# Altium schematic sheet MCU.SchDoc
size A4
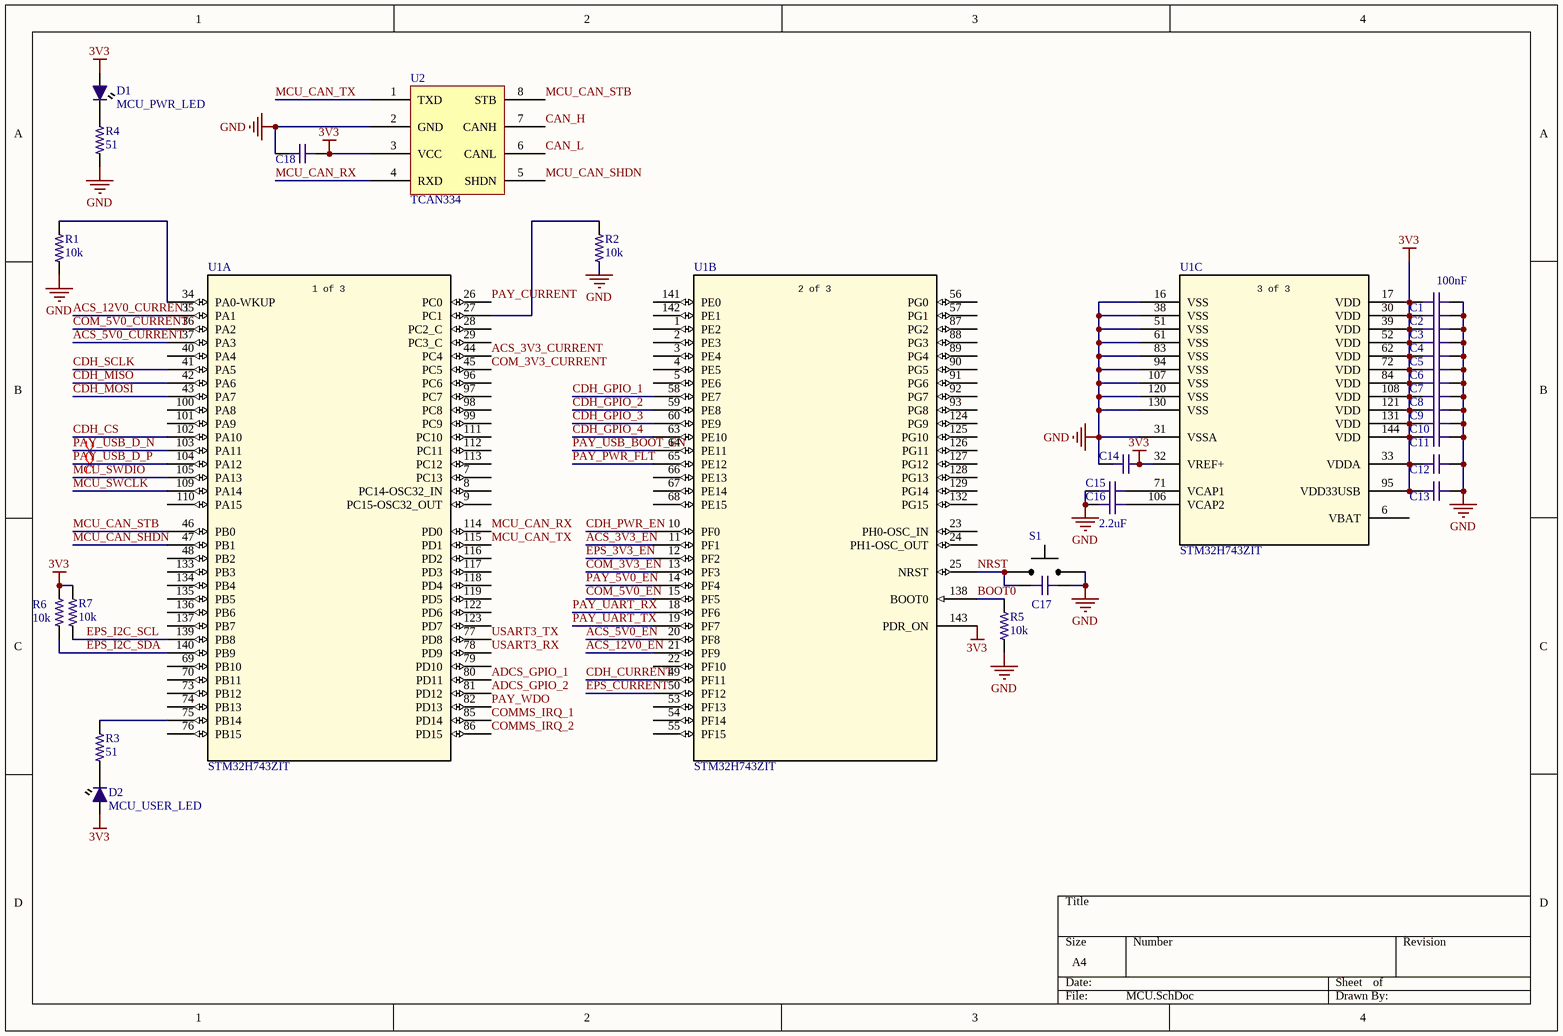
[diagram p0: MCU.SchDoc]

## Parts
C1  value 100nF  [C0603-IPC]  (hidden comment: Capacitor)
C2  Capacitor  [C0603-IPC]  (value not drawn)
C3  Capacitor  [C0603-IPC]  (value not drawn)
C4  Capacitor  [C0603-IPC]  (value not drawn)
C5  Capacitor  [C0603-IPC]  (value not drawn)
C6  Capacitor  [C0603-IPC]  (value not drawn)
C7  Capacitor  [C0603-IPC]  (value not drawn)
C8  Capacitor  [C0603-IPC]  (value not drawn)
C9  Capacitor  [C0603-IPC]  (value not drawn)
C10  Capacitor  [C0603-IPC]  (value not drawn)
C11  Capacitor  [C0603-IPC]  (value not drawn)
C12  Capacitor  [C0603-IPC]  (value not drawn)
C13  Capacitor  [C0603-IPC]  (value not drawn)
C14  Capacitor  [C0603-IPC]  (value not drawn)
C15  Capacitor  [C0603-IPC]  (value not drawn)
C16  value 2.2uF  [C0603-IPC]  (hidden comment: Capacitor)
C17  Capacitor  [C0603-IPC]  (value not drawn)
C18  Capacitor  [C0603-IPC]  (value not drawn)
D1  MCU_PWR_LED  [LED0603-IPC]
D2  MCU_USER_LED  [LED0603-IPC]
R1  value 10k  [R0603-IPC]  (hidden comment: Resistor)
R2  value 10k  [R0603-IPC]  (hidden comment: Resistor)
R3  value 51  [R0603-IPC]  (hidden comment: Resistor)
R4  value 51  [R0603-IPC]  (hidden comment: 0603 Template)
R5  value 10k  [R0603-IPC]  (hidden comment: Resistor)
R6  value 10k  [R0603-IPC]  (hidden comment: Resistor)
R7  value 10k  [R0603-IPC]  (hidden comment: Resistor)
S1  PTS810  [PTS810]  (value not drawn)
U1  STM32H743ZIT  [LQFP50P2200X2200X160-144N]  (parts A,B,C of 3)
U2  TCAN334  [SOIC127P600X175-8N]

## Nets
3V3: C1.1 C2.1 C3.1 C4.1 C5.1 C6.1 C7.1 C8.1 C9.1 C10.1 C11.1 C12.1 C13.1 C14.2 C18.2 D1.A D2.A R6.2 R7.2 U1.17(VDD) U1.30(VDD) U1.32(VREF+) U1.33(VDDA) U1.39(VDD) U1.52(VDD) U1.62(VDD) U1.72(VDD) U1.84(VDD) U1.95(VDD33USB) U1.108(VDD) U1.121(VDD) U1.131(VDD) U1.143(PDR_ON) U1.144(VDD) U2.3(VCC)
GND: C1.2 C2.2 C3.2 C4.2 C5.2 C6.2 C7.2 C8.2 C9.2 C10.2 C11.2 C12.2 C13.2 C14.1 C15.1 C16.1 C17.2 C18.1 R1.1 R2.1 R4.2 R5.1 S1.2 U1.16(VSS) U1.31(VSSA) U1.38(VSS) U1.51(VSS) U1.61(VSS) U1.83(VSS) U1.94(VSS) U1.107(VSS) U1.120(VSS) U1.130(VSS) U2.2(GND)
ACS_3V3_CURRENT: U1.44(PC4)
ACS_3V3_EN: U1.11(PF1)
ACS_5V0_CURRENT: U1.37(PA3)
ACS_5V0_EN: U1.20(PF8)
ACS_12V0_CURRENT: U1.35(PA1)
ACS_12V0_EN: U1.21(PF9)
ADCS_GPIO_1: U1.80(PD11)
ADCS_GPIO_2: U1.81(PD12)
BOOT0: R5.2 U1.138(BOOT0)
CAN_H: U2.7(CANH)
CAN_L: U2.6(CANL)
CDH_CS: U1.102(PA10)
CDH_CURRENT: U1.49(PF11)
CDH_GPIO_1: U1.58(PE7)
CDH_GPIO_2: U1.59(PE8)
CDH_GPIO_3: U1.60(PE9)
CDH_GPIO_4: U1.63(PE10)
CDH_MISO: U1.42(PA6)
CDH_MOSI: U1.43(PA7)
CDH_PWR_EN: U1.10(PF0)
CDH_SCLK: U1.41(PA5)
COM_3V3_CURRENT: U1.45(PC5)
COM_3V3_EN: U1.13(PF3)
COM_5V0_CURRENT: U1.36(PA2)
COM_5V0_EN: U1.15(PF5)
COMMS_IRQ_1: U1.85(PD14)
COMMS_IRQ_2: U1.86(PD15)
EPS_3V3_EN: U1.12(PF2)
EPS_CURRENT: U1.50(PF12)
EPS_I2C_SCL: R7.1 U1.139(PB8)
EPS_I2C_SDA: R6.1 U1.140(PB9)
MCU_CAN_RX: U1.114(PD0) U2.4(RXD)
MCU_CAN_SHDN: U1.47(PB1) U2.5(SHDN)
MCU_CAN_STB: U1.46(PB0) U2.8(STB)
MCU_CAN_TX: U1.115(PD1) U2.1(TXD)
MCU_SWCLK: U1.109(PA14)
MCU_SWDIO: U1.105(PA13)
NRST: C17.1 S1.1 U1.25(NRST)
PAY_5V0_EN: U1.14(PF4)
PAY_CURRENT: U1.26(PC0)
PAY_PWR_FLT: U1.65(PE12)
PAY_UART_RX: U1.18(PF6)
PAY_UART_TX: U1.19(PF7)
PAY_USB_BOOT_EN: U1.64(PE11)
PAY_USB_D_N: U1.103(PA11)
PAY_USB_D_P: U1.104(PA12)
PAY_WDO: U1.82(PD13)
USART3_RX: U1.78(PD9)
USART3_TX: U1.77(PD8)
NetC15_2: C15.2 U1.71(VCAP1)
NetC16_2: C16.2 U1.106(VCAP2)
NetD1_K: D1.K R4.1
NetD2_K: D2.K R3.1
NetR1_2: R1.2 U1.34(PA0-WKUP)
NetR2_2: R2.2 U1.27(PC1)
NetR3_2: R3.2 U1.75(PB14)

Not connected (* = marked no-connect by the designer): U1 1(PE2) 2(PE3) 3(PE4) 4(PE5) 5(PE6) 6(VBAT) 7(PC13) 8(PC14-OSC32_IN) 9(PC15-OSC32_OUT) 22(PF10) 23(PH0-OSC_IN) 24(PH1-OSC_OUT) 28(PC2_C) 29(PC3_C) 40(PA4) 48(PB2) 53(PF13) 54(PF14) 55(PF15) 56(PG0) 57(PG1) 66(PE13) 67(PE14) 68(PE15) 69(PB10) 70(PB11) 73(PB12) 74(PB13) 76(PB15) 79(PD10) 87(PG2) 88(PG3) 89(PG4) 90(PG5) 91(PG6) 92(PG7) 93(PG8) 96(PC6) 97(PC7) 98(PC8) 99(PC9) 100(PA8) 101(PA9) 110(PA15) 111(PC10) 112(PC11) 113(PC12) 116(PD2) 117(PD3) 118(PD4) 119(PD5) 122(PD6) 123(PD7) 124(PG9) 125(PG10) 126(PG11) 127(PG12) 128(PG13) 129(PG14) 132(PG15) 133(PB3) 134(PB4) 135(PB5) 136(PB6) 137(PB7) 141(PE0) 142(PE1)

## Layout directives
differential pair: PAY_USB_D_N, PAY_USB_D_P

## Notes on the sheet
- (in symbol 25, part A) 1 of 3
- (in symbol 25, part B) 2 of 3
- (in symbol 25, part C) 3 of 3

## Library data of the parts
C1-C13 C17 C18 = 13: Chip Capacitor, 0603, 100nF, 10V, X7R; OrbitPartId: 13; Type: Passive; EIA Code: X7R; Max. Voltage: 10V; PartId: 1; Subtype: Capacitor
  C2-C13 C17 C18: Value: 100nF
C14 = 13: Chip Capacitor, 0603, 10nF, 10V, X7R; OrbitPartId: 13; Type: Passive; EIA Code: X7R; Max. Voltage: 10V; Value: 10nF; PartId: 1; Subtype: Capacitor
C15 C16 = 13: Chip Capacitor, 0603, 2.2uF, 10V, X7R; OrbitPartId: 13; Type: Passive; EIA Code: X7R; Max. Voltage: 10V; PartId: 1; Subtype: Capacitor
  C15: Value: 2.2uF
D1 = LED 0603 SMD: Red PWR_LED; Supplier 1: Digi-Key; Supplier Part Number 1: 732-4966-1-ND
D2 = LED 0603 SMD: Blue DEBUG_LED; Supplier 1: Digi-Key; Supplier Part Number 1: 732-4966-1-ND
R1-R3 R5-R7 = 20: Resistor (0603); OrbitPartId: 20; PartId: 1; Type: Passive; Subtype: Resistor
R4 = 0603 Template: Chip Resistor, 0603, 51hms, 0.1W
S1 = 39: PTS810 Switch (Tactile); OrbitPartId: 39; Manufacturer: C&K; Part Number: PTS810 SJM 250 SMTR LFS; PartId: 1; Supplier 1: Digi-Key; Supplier Part Number 1: CKN10502CT-ND; Type: Switch; Subtype: Tactile
U1 = 25: STM32H743ZIT MCU; OrbitPartId: 25; Manufacturer: STMicroelectronics; Part Number: STM32H743ZIT6; Subtype: Microcontroller; PartId: 1; Supplier 1: Digi-Key; Supplier Part Number 1: 497-17721-ND; Type: Integrated Circuit
U2 = 26: TCAN334 CAN Transceiver; OrbitPartId: 26; Manufacturer: Texas Instruments; Part Number: TCAN334DCNT; PartId: 1; Supplier 1: Digi-Key; Supplier Part Number 1: 296-44503-1-ND; Type: Integrated Circuit; Subtype: CAN Transceiver